# EAGLE design TL431_VoltageSupply (EAGLE 7.6.0)
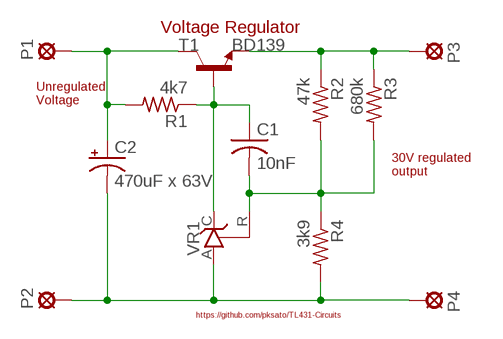
[diagram p0: schematic, sheet 1]

## Parts
C1  10nF  C-US050-024X044  [C050-024X044]
C2  470uF x 63V  CPOL-USE5-13  [E5-13]
P1  LSP10  [LSP10]
P2  LSP10  [LSP10]
P3  LSP10  [LSP10]
P4  LSP10  [LSP10]
R1  4k7  R-US_0207/10  [0207/10]
R2  47k  R-US_0207/10  [0207/10]
R3  680k  R-US_0207/10  [0207/10]
R4  3k9  R-US_0207/10  [0207/10]
T1  BD139  [TO126]
VR1  TL431CLP  [TO92-CLP]

## Nets
N$1: P3.MP R2.1 R3.1 T1.1(E)
N$2: C1.1 R1.1 T1.3(B) VR1.C
N$3: C1.2 R2.2 R3.2 R4.1 VR1.R
N$5: C2.+ P1.MP R1.2 T1.2(C)
N$6: C2.- P2.MP P4.MP R4.2 VR1.A

## Notes on the sheet
- Voltage Regulator
- Unregulated
  Voltage
- 30V regulated
  output
- https://github.com/pksato/TL431-Circuits

## Library data of the parts
C1 = rcl:C-US: CAPACITOR, American symbol
C2 = rcl:CPOL-US: POLARIZED CAPACITOR, American symbol
P1-P4 = solpad:LSP10: SOLDER PAD drill 1.0 mm, distributor Buerklin, 12H555
R1-R4 = rcl:R-US_: RESISTOR, American symbol
T1 = transistor-neu-to92:BD139: NPN TRANSISTOR
VR1 = v-reg:TL431CLP: VOLTAGE REGULATOR

## Board
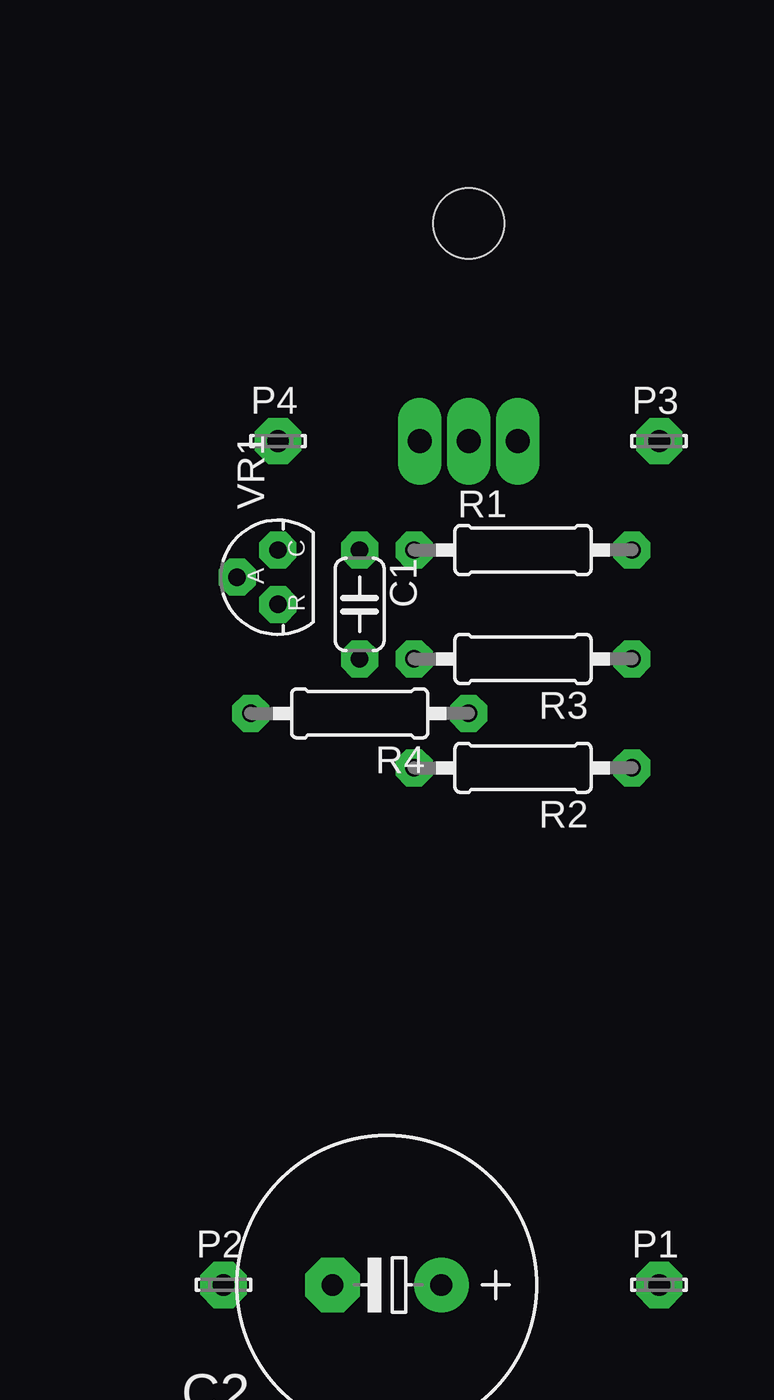
[diagram p1: board, top side]
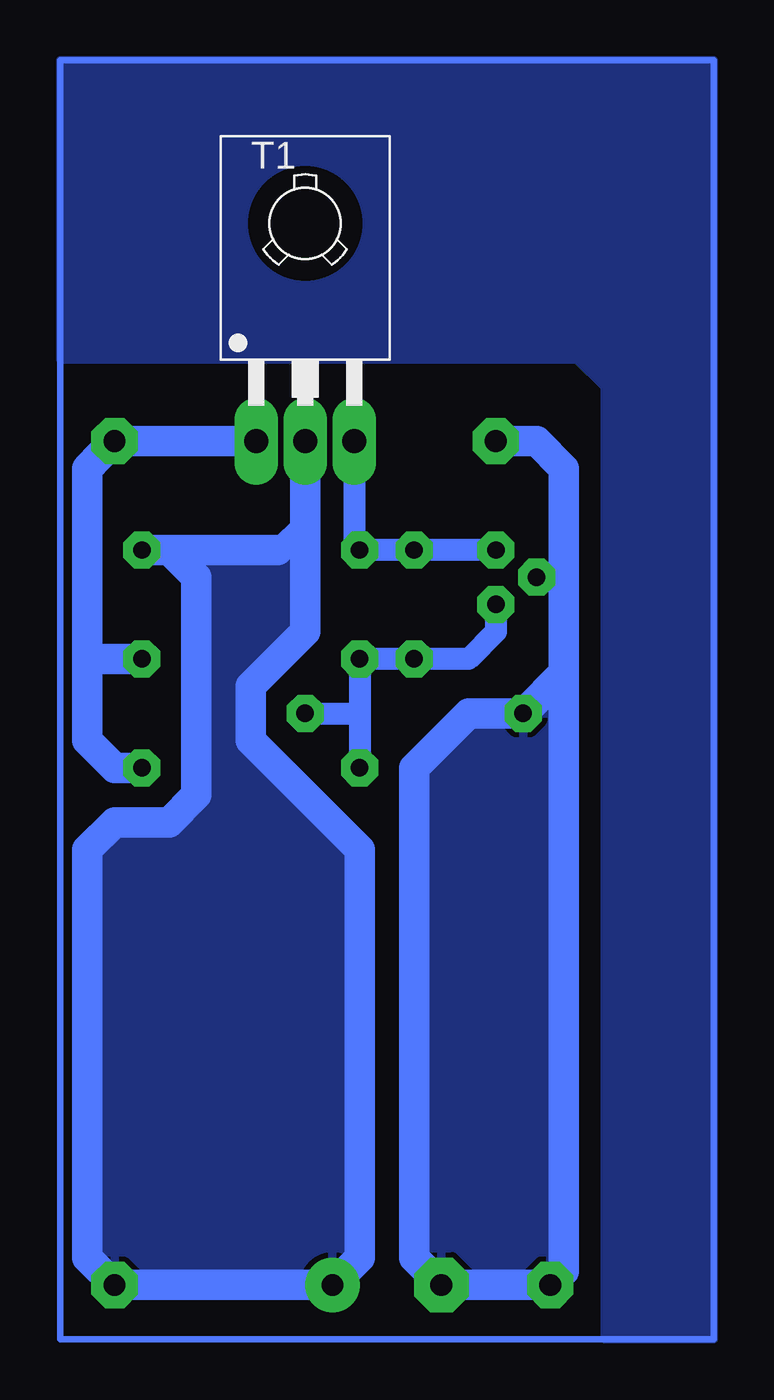
[diagram p2: board, bottom side, seen from below]

No outline drawn. Coordinates in mm, seen from the top.
Copper layers (1*16): Top 0.035mm / dielectric 1.5mm / Bottom 0.035mm
Design rules "default *": minimum track width 10mil, minimum drill 12mil, track to track 8mil, track to pad 8mil, pad to pad 8mil, via to via 8mil, smd to smd 8mil, copper to edge 40mil, drill to drill 8mil, minimum pad ring 18mil, minimum via ring 8mil, stop-mask expansion 8mil, vias tented up to drill 0mil, thermal gap 10mil

### Footprints (pad centres in the part's own frame; a part is rotated, then mirrored left to right if it is on the bottom)
C050-024X044 = drill 0.813 octagon: 1 -2.54,0; 2 2.54,0
E5-13 = drill 1.016 pad 2.54: + -2.54,0 | drill 1.016 pad 2.54 octagon: - 2.54,0
LSP10 = drill 1.016 pad 2.159 octagon: MP 0,0
0207/10 = drill 0.813 octagon: 1 -5.08,0; 2 5.08,0
TO126 = drill 1.118 long: 1 -2.286,-5.08; 2 0,-5.08; 3 2.286,-5.08 | hole 3.302: 0,5.08
TO92-CLP = drill 0.813 octagon: A 0,1.905; C 1.27,0; R -1.27,0

### Placement (x,y rotation side)
C1  13.97,34.29 270 top
C2  15.24,2.54 180 top
P1  27.94,2.54 0 top
P2  7.62,2.54 0 top
P3  27.94,41.91 0 top
P4  10.16,41.91 0 top
R1  21.59,36.83 0 top
R2  21.59,26.67 180 top
R3  21.59,31.75 180 top
R4  13.97,29.21 180 top
T1  19.05,46.99 0 bottom
VR1  10.16,35.56 90 top

### Tracks (layer width: path | path; a pad name or v marks a point on that pad's centre or on a via)
BRD
  Bottom 0.305: 0,0 30.48,0 30.48,59.69 0,59.69 0,0
  pour Bottom: 0,0 5.08,0 5.08,44.45 6.35,45.72 30.48,45.72 30.48,59.69 0,59.69
N$1
  Bottom 1.422: 29.21,31.75 29.21,40.64 28.57,41.27 P3.MP T1.1 | 29.21,31.75 29.21,27.94 27.94,26.67 R2.1 | R3.1 29.21,31.75
N$2
  Bottom 1.016: VR1.C C1.1 R1.1 16.76,37.08 T1.3
N$3
  Bottom 1.016: 16.51,29.21 R3.2 C1.2 11.43,31.75 10.16,33.02 VR1.R | 16.51,29.21 R2.2 | R4.1 16.51,29.21
N$5
  Bottom 1.016: 20.32,36.83 19.05,38.1
  Bottom 1.422: T1.2 19.05,38.1 19.05,33.02 21.59,30.48 21.59,27.94 16.51,22.86 16.51,3.81 C2.+ P1.MP 29.21,3.81 29.21,22.86 27.94,24.13 25.4,24.13 24.13,25.4 24.13,35.56 25.4,36.83 | R1.2 25.4,36.83 | 25.4,36.83 20.32,36.83
  pour Bottom: 17.78,2.54 27.94,2.54 29.21,3.81 29.21,22.86 27.94,24.13 25.4,24.13 24.13,25.4 24.13,35.56 25.4,36.83 20.32,36.83 19.05,38.1 19.05,33.02 21.59,30.48 21.59,27.94 16.51,22.86 16.51,3.81
N$6
  Bottom 1.422: 6.99,35.56 6.99,31.11 | VR1.A 6.99,35.56 | 6.99,35.56 6.99,40.64 8.26,41.91 P4.MP | 6.99,31.11 R4.2 11.43,29.21 13.97,26.67 13.97,3.81 C2.- P2.MP 6.99,3.17 6.99,31.11
  pour Bottom: 7.62,2.54 12.7,2.54 13.97,3.81 13.97,26.67 11.43,29.21 8.89,29.21 7.62,30.48